# Altium schematic sheet Top_level.SchDoc
size 420 x 297 mm
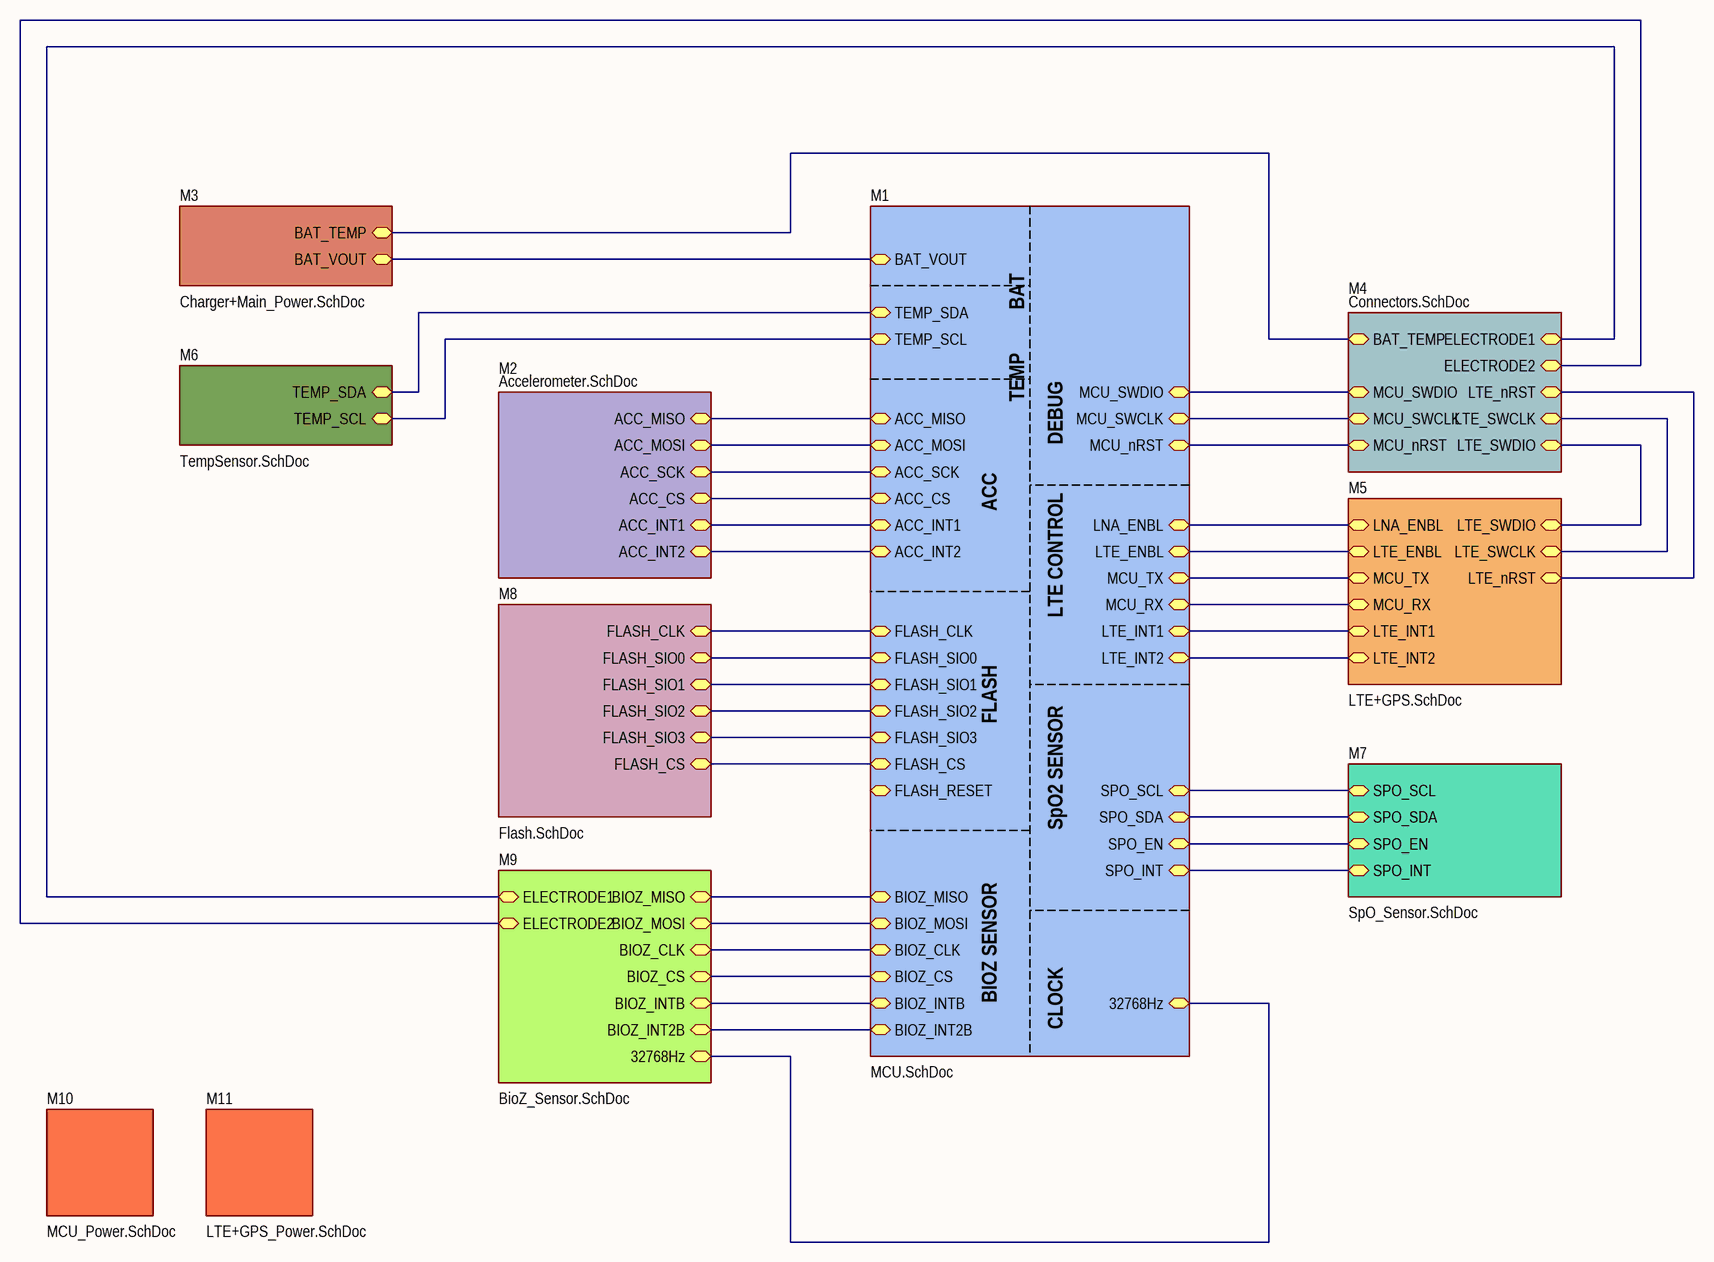
[diagram p0: Top_level.SchDoc]

## Sub-sheets
M1 = MCU.SchDoc: BAT_VOUT (bidir), TEMP_SDA (bidir), TEMP_SCL (bidir), ACC_INT2 (bidir), ACC_CS (bidir), LTE_ENBL (bidir), MCU_RX (bidir), ACC_MISO (bidir), ACC_MOSI (bidir), MCU_TX (bidir), MCU_nRST (bidir), MCU_SWCLK (bidir), MCU_SWDIO (bidir), ACC_INT1 (bidir), ACC_SCK (bidir), LNA_ENBL (bidir), FLASH_CS (bidir), FLASH_RESET (bidir), FLASH_SIO3 (bidir), FLASH_SIO0 (bidir), FLASH_CLK (bidir), FLASH_SIO2 (bidir), FLASH_SIO1 (bidir), 32768Hz (bidir), SPO_INT (bidir), SPO_EN (bidir), SPO_SCL (bidir), SPO_SDA (bidir), BIOZ_INT2B (bidir), BIOZ_INTB (bidir), BIOZ_MISO (bidir), BIOZ_CLK (bidir), BIOZ_MOSI (bidir), BIOZ_CS (bidir), LTE_INT1 (bidir), LTE_INT2 (bidir)
M2 = Accelerometer.SchDoc: ACC_MOSI (bidir), ACC_INT1 (bidir), ACC_CS (bidir), ACC_INT2 (bidir), ACC_SCK (bidir), ACC_MISO (bidir)
M3 = Charger+Main_Power.SchDoc: BAT_TEMP (bidir), BAT_VOUT (bidir)
M4 = Connectors.SchDoc: BAT_TEMP (bidir), MCU_SWDIO (bidir), MCU_nRST (bidir), MCU_SWCLK (bidir), ELECTRODE2 (bidir), ELECTRODE1 (bidir), LTE_SWDIO (bidir), LTE_nRST (bidir), LTE_SWCLK (bidir)
M5 = LTE+GPS.SchDoc: LNA_ENBL (bidir), LTE_ENBL (bidir), MCU_RX (bidir), MCU_TX (bidir), LTE_INT2 (bidir), LTE_INT1 (bidir), LTE_SWDIO (bidir), LTE_SWCLK (bidir), LTE_nRST (bidir)
M6 = TempSensor.SchDoc: TEMP_SCL (bidir), TEMP_SDA (bidir)
M7 = SpO_Sensor.SchDoc: SPO_SCL (bidir), SPO_INT (bidir), SPO_SDA (bidir), SPO_EN (bidir)
M8 = Flash.SchDoc: FLASH_CS (bidir), FLASH_SIO3 (bidir), FLASH_SIO0 (bidir), FLASH_CLK (bidir), FLASH_SIO2 (bidir), FLASH_SIO1 (bidir)
M9 = BioZ_Sensor.SchDoc: BIOZ_MISO (bidir), 32768Hz (bidir), BIOZ_CS (bidir), BIOZ_CLK (bidir), BIOZ_INTB (bidir), BIOZ_MOSI (bidir), ELECTRODE2 (bidir), ELECTRODE1 (bidir), BIOZ_INT2B (bidir)
M10 = MCU_Power.SchDoc: no entries
M11 = LTE+GPS_Power.SchDoc: no entries

## Nets
(unnamed): sheet M1/BAT_VOUT, sheet M3/BAT_VOUT
(unnamed): sheet M1/TEMP_SDA, sheet M6/TEMP_SDA
(unnamed): sheet M1/TEMP_SCL, sheet M6/TEMP_SCL
(unnamed): sheet M1/ACC_INT2, sheet M2/ACC_INT2
(unnamed): sheet M1/ACC_CS, sheet M2/ACC_CS
(unnamed): sheet M1/LTE_ENBL, sheet M5/LTE_ENBL
(unnamed): sheet M1/MCU_RX, sheet M5/MCU_RX
(unnamed): sheet M1/ACC_MISO, sheet M2/ACC_MISO
(unnamed): sheet M1/ACC_MOSI, sheet M2/ACC_MOSI
(unnamed): sheet M1/MCU_TX, sheet M5/MCU_TX
(unnamed): sheet M1/MCU_nRST, sheet M4/MCU_nRST
(unnamed): sheet M1/MCU_SWCLK, sheet M4/MCU_SWCLK
(unnamed): sheet M1/MCU_SWDIO, sheet M4/MCU_SWDIO
(unnamed): sheet M1/ACC_INT1, sheet M2/ACC_INT1
(unnamed): sheet M1/ACC_SCK, sheet M2/ACC_SCK
(unnamed): sheet M1/LNA_ENBL, sheet M5/LNA_ENBL
(unnamed): sheet M1/FLASH_CS, sheet M8/FLASH_CS
(unnamed): sheet M1/FLASH_SIO3, sheet M8/FLASH_SIO3
(unnamed): sheet M1/FLASH_SIO0, sheet M8/FLASH_SIO0
(unnamed): sheet M1/FLASH_CLK, sheet M8/FLASH_CLK
(unnamed): sheet M1/FLASH_SIO2, sheet M8/FLASH_SIO2
(unnamed): sheet M1/FLASH_SIO1, sheet M8/FLASH_SIO1
(unnamed): sheet M1/32768Hz, sheet M9/32768Hz
(unnamed): sheet M1/SPO_INT, sheet M7/SPO_INT
(unnamed): sheet M1/SPO_EN, sheet M7/SPO_EN
(unnamed): sheet M1/SPO_SCL, sheet M7/SPO_SCL
(unnamed): sheet M1/SPO_SDA, sheet M7/SPO_SDA
(unnamed): sheet M1/BIOZ_INT2B, sheet M9/BIOZ_INT2B
(unnamed): sheet M1/BIOZ_INTB, sheet M9/BIOZ_INTB
(unnamed): sheet M1/BIOZ_MISO, sheet M9/BIOZ_MISO
(unnamed): sheet M1/BIOZ_CLK, sheet M9/BIOZ_CLK
(unnamed): sheet M1/BIOZ_MOSI, sheet M9/BIOZ_MOSI
(unnamed): sheet M1/BIOZ_CS, sheet M9/BIOZ_CS
(unnamed): sheet M1/LTE_INT1, sheet M5/LTE_INT1
(unnamed): sheet M1/LTE_INT2, sheet M5/LTE_INT2
(unnamed): sheet M3/BAT_TEMP, sheet M4/BAT_TEMP
(unnamed): sheet M4/ELECTRODE2, sheet M9/ELECTRODE2
(unnamed): sheet M4/ELECTRODE1, sheet M9/ELECTRODE1
(unnamed): sheet M4/LTE_SWDIO, sheet M5/LTE_SWDIO
(unnamed): sheet M4/LTE_nRST, sheet M5/LTE_nRST
(unnamed): sheet M4/LTE_SWCLK, sheet M5/LTE_SWCLK

## Notes on the sheet
- BAT
- TEMP
- DEBUG
- ACC
- LTE CONTROL
- FLASH
- SpO2 SENSOR
- BIOZ SENSOR
- CLOCK
- Author
- Manufacturer
- Date
- Page
- Total pages
- Size page
- A3
- Materials